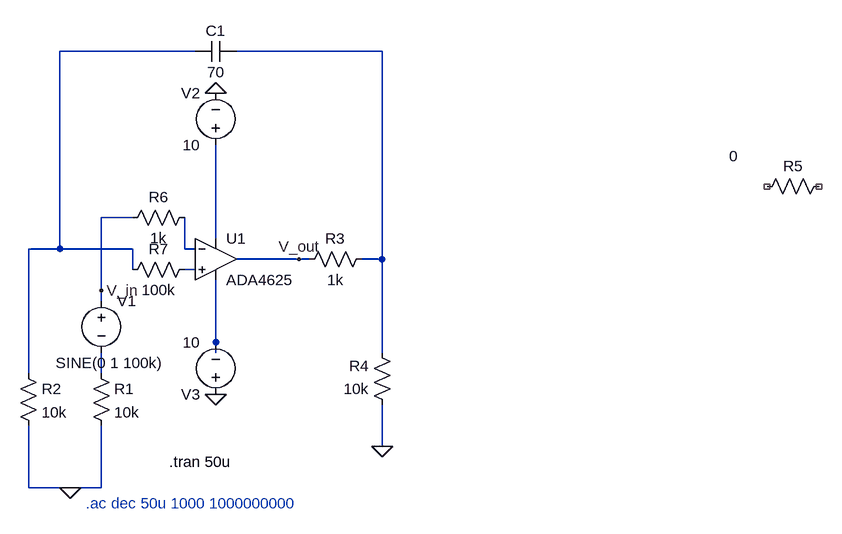
[diagram p0: schematic bol_sxema1_laba4.asc]
bol_sxema1_laba4.asc, the LTspice schematic file:
Version 4.1
SHEET 1 1144 680
WIRE 176 -256 -32 -256
WIRE 464 -256 240 -256
WIRE 80 0 32 0
WIRE 208 32 208 -112
WIRE -32 48 -32 -256
WIRE -32 48 -80 48
WIRE 80 48 -32 48
WIRE 160 48 160 0
WIRE 176 48 160 48
WIRE 336 64 240 64
WIRE 352 64 336 64
WIRE 464 64 464 -256
WIRE 464 64 432 64
WIRE 80 80 80 48
WIRE 176 80 160 80
WIRE 32 112 32 0
WIRE 32 128 32 112
WIRE 208 192 208 96
WIRE 208 208 208 192
WIRE 464 208 464 64
WIRE -80 240 -80 48
WIRE 32 240 32 208
WIRE 464 352 464 288
WIRE -80 416 -80 320
WIRE -16 416 -80 416
WIRE 32 416 32 320
WIRE 32 416 -16 416
FLAG -16 416 0
FLAG 464 352 0
FLAG 208 272 0
FLAG 208 -192 0
FLAG 32 112 V_in
FLAG 336 64 V_out
SYMBOL res 16 224 R0
SYMATTR InstName R1
SYMATTR Value 10k
SYMBOL res -96 224 R0
SYMATTR InstName R2
SYMATTR Value 10k
SYMBOL OpAmps\\ADA4625 208 0 R0
SYMATTR InstName U1
SYMBOL voltage 32 112 R0
WINDOW 3 -70 112 Left 2
WINDOW 123 0 0 Left 0
WINDOW 39 0 0 Left 0
SYMATTR InstName V1
SYMATTR Value SINE(0 1 100k)
SYMBOL res 448 48 R90
WINDOW 0 0 56 VBottom 2
WINDOW 3 32 56 VTop 2
SYMATTR InstName R3
SYMATTR Value 1k
SYMBOL res 480 304 R180
WINDOW 0 36 76 Left 2
WINDOW 3 36 40 Left 2
SYMATTR InstName R4
SYMATTR Value 10k
SYMBOL res 1152 -64 R90
WINDOW 0 0 56 VBottom 2
WINDOW 3 -15 147 VBottom 2
SYMATTR InstName R5
SYMATTR Value 0
SYMBOL voltage 208 -96 R180
WINDOW 0 24 96 Left 2
WINDOW 3 24 16 Left 2
WINDOW 123 0 0 Left 0
WINDOW 39 0 0 Left 0
SYMATTR InstName V2
SYMATTR Value 10
SYMBOL voltage 208 288 R180
WINDOW 123 0 0 Left 0
WINDOW 39 0 0 Left 0
SYMATTR InstName V3
SYMATTR Value 10
SYMBOL res 176 -16 R90
WINDOW 0 0 56 VBottom 2
WINDOW 3 32 56 VTop 2
SYMATTR InstName R6
SYMATTR Value 1k
SYMBOL res 176 64 R90
WINDOW 0 0 56 VBottom 2
WINDOW 3 32 56 VTop 2
SYMATTR InstName R7
SYMATTR Value 100k
SYMBOL cap 240 -272 R90
WINDOW 0 0 32 VBottom 2
WINDOW 3 32 32 VTop 2
SYMATTR InstName C1
SYMATTR Value 70
TEXT 8 440 Left 2 ;.ac dec 50u 1000 1000000000
TEXT 136 376 Left 2 !.tran 50u

The netlist it stands for:
* bol_sxema1_laba4.asc
R1 N007 0 10k
R2 N001 0 10k
X§U1 N005 N004 N003 N006 V_out ADA4625  ; pins In+ In- V+ V- OUT
V1 V_in N007 SINE(0 1 100k)
R3 N002 V_out 1k
R4 0 N002 10k
R5 NC_01 NC_02 0
V2 N003 0 10
V3 0 N006 10
R6 N004 V_in 1k
R7 N005 N001 100k
C1 N002 N001 70
* .ac dec 50u 1000 1000000000
.tran 50u
.backanno
.end